# EAGLE schematic xplained-add-on-board-rev0 (EAGLE 6.4)
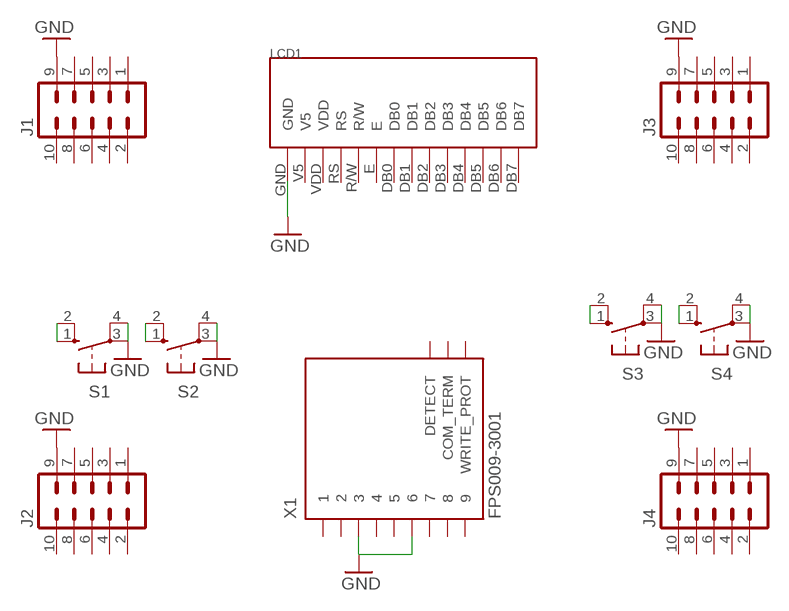
[diagram p0: schematic, sheet 1]

## Parts
J1  ML10  [ML10]
J2  ML10  [ML10]
J3  ML10  [ML10]
J4  ML10  [ML10]
LCD1  NHD-C0220AA-FSW-FTW  [NHD-C0220AA-FSW-FTW]
S1  10-XX  [B3F-10XX]
S2  10-XX  [B3F-10XX]
S3  10-XX  [B3F-10XX]
S4  10-XX  [B3F-10XX]
X1  FPS009-3001  [FPS009-3000]

## Nets
GND: J1.9 J2.9 J3.9 J4.9 S1.3(P) S1.4(P1) S2.3(P) S2.4(P1) S3.3(P) S3.4(P1) S4.3(P) S4.4(P1) X1.3 X1.6
N$1: S1.1(S) S1.2(S1)
N$2: S2.1(S) S2.2(S1)
N$3: S3.1(S) S3.2(S1)
N$4: S4.1(S) S4.2(S1)
Unconnected: J1.1 J1.2 J1.3 J1.4 J1.5 J1.6 J1.7 J1.8 J1.10 J2.1 J2.2 J2.3 J2.4 J2.5 J2.6 J2.7 J2.8 J2.10 J3.1 J3.2 J3.3 J3.4 J3.5 J3.6 J3.7 J3.8 J3.10 J4.1 J4.2 J4.3 J4.4 J4.5 J4.6 J4.7 J4.8 J4.10 LCD1.DB0 LCD1.DB1 LCD1.DB2 LCD1.DB3 LCD1.DB4 LCD1.DB5 LCD1.DB6 LCD1.DB7 LCD1.E LCD1.GND LCD1.R/W LCD1.RS LCD1.V5 LCD1.VDD X1.1 X1.2 X1.4 X1.5 X1.7 X1.8 X1.9 X1.COM_TERM X1.DETECT X1.WRITE_PROT

## Library data of the parts
J1-J4 = con-ml:ML10: HARTING; OC_FARNELL: unknown; OC_NEWARK: unknown
LCD1 = NHD-C0220AA-FSW-FTW:NHD-C0220AA-FSW-FTW: NHD-C0220AA-FSW-FTW http://www.newhavendisplay.com/specs/NHD-C0220AA-FSW-FTW.pdf COG (Chip-on-Glass) Liquid Crystal Display Module NHD Newhaven Display C0220 COG, 2 lines x 20 characters AA Model F Transflective SW Side White LED backlight F FSTN+ T 12:00 View Angle W Wide Temp (‐20°C ~ +70°C) RoHS Compliant www.newhavendisplay.com
S1-S4 = switch-omron:10-XX: OMRON SWITCH; MPN: B3F-1000; OC_FARNELL: 176432; OC_NEWARK: 36M3542
X1 = con-yamaichi:FPS009-300*: SD Card and MMC Reader (Manual Insertion) Source: http://www.yamaichi.de/pdf/c_fps009_3000.pdf; MPN: FPS009-3001-BL; OC_FARNELL: 1143952; OC_NEWARK: 91K9875